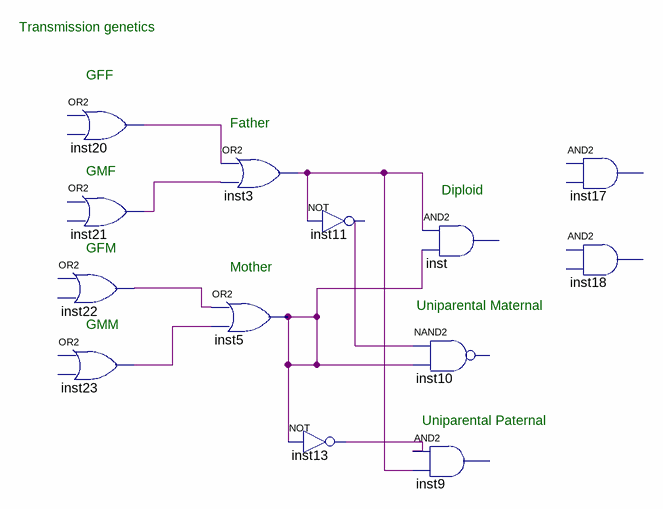
[diagram p0: schematic sheet]
// Quartus schematic CycloneII_LogicGates_20120122.bdf as structural Verilog: 13 symbols, 0 pins
module CycloneII_LogicGates_20120122 (
);

  wire inst3_out, inst5_out, inst11_out, inst13_out, inst20_out, inst21_out, inst22_out, inst23_out;

  // OR2 inst20 has open pins: IN1=open, IN2=open, OUT=inst20_out
  // OR2 inst21 has open pins: IN1=open, IN2=open, OUT=inst21_out
  // OR2 inst22 has open pins: IN1=open, IN2=open, OUT=inst22_out
  // OR2 inst23 has open pins: IN1=open, IN2=open, OUT=inst23_out
  or inst3 (inst3_out, inst20_out, inst21_out);
  or inst5 (inst5_out, inst22_out, inst23_out);
  not inst11 (inst11_out, inst3_out);
  not inst13 (inst13_out, inst5_out);
  // AND2 inst has open pins: IN1=inst3_out, IN2=inst5_out, OUT=open
  // NAND2 inst10 has open pins: IN1=inst11_out, IN2=inst5_out, OUT=open
  // AND2 inst9 has open pins: IN1=inst13_out, IN2=inst3_out, OUT=open
  // AND2 inst17 is placed but not wired
  // AND2 inst18 is placed but not wired

  // Notes on the sheet:
  //   Transmission genetics
  //   GFF
  //   Father
  //   GMF
  //   Diploid
  //   GFM
  //   Mother
  //    Uniparental Maternal
  //   GMM
  //   Uniparental Paternal
endmodule
